# Altium schematic sheet FPGA_POWER.SchDoc
size A4
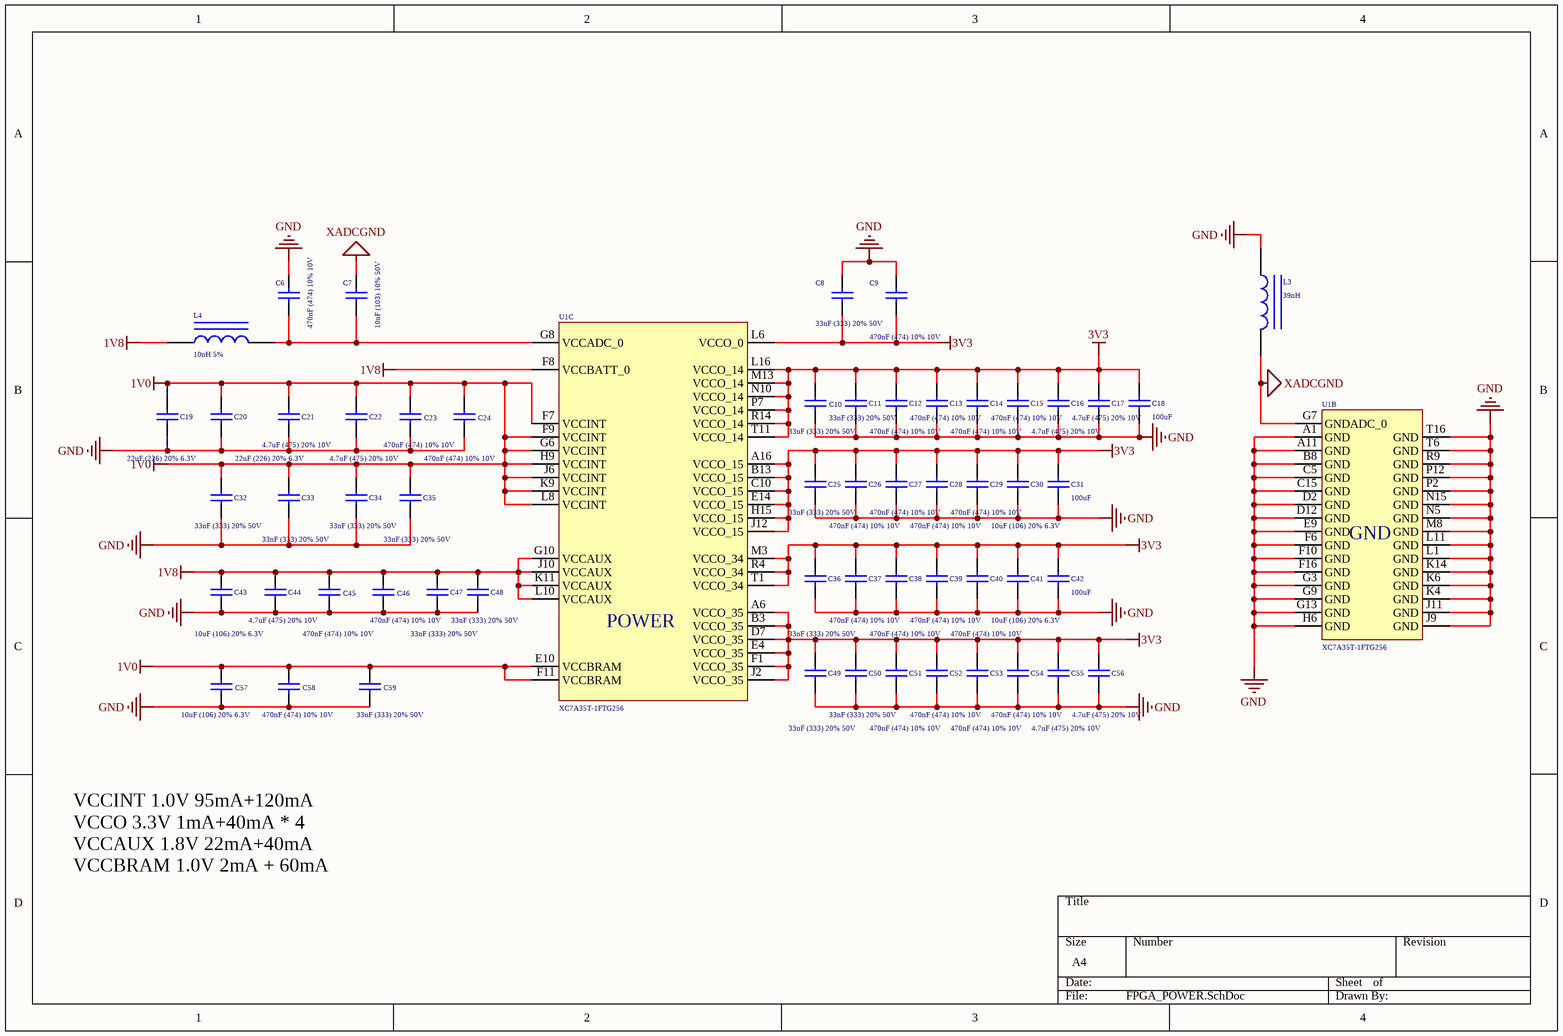
[diagram p0: FPGA_POWER.SchDoc]

## Parts
C6  470nF (474) 10% 10V  [0402_C]
C7  10nF (103) 10% 50V  [0402_C]
C8  33nF (333) 20% 50V  [0402_C]
C9  470nF (474) 10% 10V  [0402_C]
C10  33nF (333) 20% 50V  [0402_C]
C11  33nF (333) 20% 50V  [0402_C]
C12  470nF (474) 10% 10V  [0402_C]
C13  470nF (474) 10% 10V  [0402_C]
C14  470nF (474) 10% 10V  [0402_C]
C15  470nF (474) 10% 10V  [0402_C]
C16  4.7uF (475) 20% 10V  [0402_C]
C17  4.7uF (475) 20% 10V  [0402_C]
C18  value 100uF  [LC-1206]  (hidden comment: Cap)
C19  22uF (226) 20% 6.3V  [0603_C]
C20  22uF (226) 20% 6.3V  [0603_C]
C21  4.7uF (475) 20% 10V  [0402_C]
C22  4.7uF (475) 20% 10V  [0402_C]
C23  470nF (474) 10% 10V  [0402_C]
C24  470nF (474) 10% 10V  [0402_C]
C25  33nF (333) 20% 50V  [0402_C]
C26  470nF (474) 10% 10V  [0402_C]
C27  470nF (474) 10% 10V  [0402_C]
C28  470nF (474) 10% 10V  [0402_C]
C29  470nF (474) 10% 10V  [0402_C]
C30  10uF (106) 20% 6.3V  [0402_C]
C31  value 100uF  [LC-1206]  (hidden comment: Cap)
C32  33nF (333) 20% 50V  [0402_C]
C33  33nF (333) 20% 50V  [0402_C]
C34  33nF (333) 20% 50V  [0402_C]
C35  33nF (333) 20% 50V  [0402_C]
C36  33nF (333) 20% 50V  [0402_C]
C37  470nF (474) 10% 10V  [0402_C]
C38  470nF (474) 10% 10V  [0402_C]
C39  470nF (474) 10% 10V  [0402_C]
C40  470nF (474) 10% 10V  [0402_C]
C41  10uF (106) 20% 6.3V  [0402_C]
C42  value 100uF  [LC-1206]  (hidden comment: Cap)
C43  10uF (106) 20% 6.3V  [0402_C]
C44  4.7uF (475) 20% 10V  [0402_C]
C45  470nF (474) 10% 10V  [0402_C]
C46  470nF (474) 10% 10V  [0402_C]
C47  33nF (333) 20% 50V  [0402_C]
C48  33nF (333) 20% 50V  [0402_C]
C49  33nF (333) 20% 50V  [0402_C]
C50  33nF (333) 20% 50V  [0402_C]
C51  470nF (474) 10% 10V  [0402_C]
C52  470nF (474) 10% 10V  [0402_C]
C53  470nF (474) 10% 10V  [0402_C]
C54  470nF (474) 10% 10V  [0402_C]
C55  4.7uF (475) 20% 10V  [0402_C]
C56  4.7uF (475) 20% 10V  [0402_C]
C57  10uF (106) 20% 6.3V  [0402_C]
C58  470nF (474) 10% 10V  [0402_C]
C59  33nF (333) 20% 50V  [0402_C]
L3  39nH  [0402_L]
L4  10nH 5%  [0402_L]
U1  XC7A35T-1FTG256  [BGA100P9X9-81A]  (parts B,C of 7)

## Nets
1V0: C19.2 C20.2 C21.2 C22.2 C23.2 C24.2 C32.2 C33.2 C34.2 C35.2 C57.2 C58.2 C59.2 U1.E10(VCCBRAM) U1.F7(VCCINT) U1.F9(VCCINT) U1.F11(VCCBRAM) U1.G6(VCCINT) U1.H9(VCCINT) U1.J6(VCCINT) U1.K9(VCCINT) U1.L8(VCCINT)
1V8: C43.2 C44.2 C45.2 C46.2 C47.2 C48.2 L4.1 U1.F8(VCCBATT_0) U1.G10(VCCAUX) U1.J10(VCCAUX) U1.K11(VCCAUX) U1.L10(VCCAUX)
3V3: C8.1 C9.1 C10.2 C11.2 C12.2 C13.2 C14.2 C15.2 C16.2 C17.2 C18.2 C25.2 C26.2 C27.2 C28.2 C29.2 C30.2 C31.2 C36.2 C37.2 C38.2 C39.2 C40.2 C41.2 C42.2 C49.2 C50.2 C51.2 C52.2 C53.2 C54.2 C55.2 C56.2 U1.A6(VCCO_35) U1.A16(VCCO_15) U1.B3(VCCO_35) U1.B13(VCCO_15) U1.C10(VCCO_15) U1.D7(VCCO_35) U1.E4(VCCO_35) U1.E14(VCCO_15) U1.F1(VCCO_35) U1.H15(VCCO_15) U1.J2(VCCO_35) U1.J12(VCCO_15) U1.L6(VCCO_0) U1.L16(VCCO_14) U1.M3(VCCO_34) U1.M13(VCCO_14) U1.N10(VCCO_14) U1.P7(VCCO_14) U1.R4(VCCO_34) U1.R14(VCCO_14) U1.T1(VCCO_34) U1.T11(VCCO_14)
GND: C6.2 C8.2 C9.2 C10.1 C11.1 C12.1 C13.1 C14.1 C15.1 C16.1 C17.1 C18.1 C19.1 C20.1 C21.1 C22.1 C23.1 C24.1 C25.1 C26.1 C27.1 C28.1 C29.1 C30.1 C31.1 C32.1 C33.1 C34.1 C35.1 C36.1 C37.1 C38.1 C39.1 C40.1 C41.1 C42.1 C43.1 C44.1 C45.1 C46.1 C47.1 C48.1 C49.1 C50.1 C51.1 C52.1 C53.1 C54.1 C55.1 C56.1 C57.1 C58.1 C59.1 L3.1 U1.A1(GND) U1.A11(GND) U1.B8(GND) U1.C5(GND) U1.C15(GND) U1.D2(GND) U1.D12(GND) U1.E9(GND) U1.F6(GND) U1.F10(GND) U1.F16(GND) U1.G3(GND) U1.G9(GND) U1.G13(GND) U1.H6(GND) U1.J9(GND) U1.J11(GND) U1.K4(GND) U1.K6(GND) U1.K14(GND) U1.L1(GND) U1.L11(GND) U1.M8(GND) U1.N5(GND) U1.N15(GND) U1.P2(GND) U1.P12(GND) U1.R9(GND) U1.T6(GND) U1.T16(GND)
XADCGND: C7.2 L3.2 U1.G7(GNDADC_0)
NetC6_1: C6.1 C7.1 L4.2 U1.G8(VCCADC_0)

## Notes on the sheet
- VCCINT 1.0V 95mA+120mA
  VCCO 3.3V 1mA+40mA * 4
  VCCAUX 1.8V 22mA+40mA
  VCCBRAM 1.0V 2mA + 60mA
- (in symbol XC7A35T-1FTG256, part C) POWER

## Library data of the parts
C6 C9 C12-C15 C23 C24 C26-C29 C37-C40 C45 C46 C51-C54 C58 = 0402 470nF (474) 10% 10V: 贴片电容; ComponentLink1Description: 供应商链接; ComponentLink1URL: http://www.szlcsc.com/product/details_48344.html; Package: 0402; Supplier: LC; SuppliersPartNumber: C47339
C7 = 0402 10nF (103) 10% 50V: 贴片电容; ComponentLink1Description: 供应商链接; ComponentLink1URL: http://www.szlcsc.com/product/details_15869.html; Package: 0402; Supplier: LC; SuppliersPartNumber: C15195
C8 C10 C11 C25 C32-C36 C47-C50 C59 = 0402 33nF (333) 20% 50V: 贴片电容; ComponentLink1Description: 供应商链接; ComponentLink1URL: http://www.szlcsc.com/product/details_1937.html; Package: 0402; Supplier: LC; SuppliersPartNumber: C1585
C16 C17 C21 C22 C44 C55 C56 = 0402 4.7uF (475) 20% 10V: 贴片电容; ComponentLink1Description: 供应商链接; ComponentLink1URL: http://www.szlcsc.com/product/details_24469.html; Package: 0402; Supplier: LC; SuppliersPartNumber: C23733
C18 C31 C42 = Cap: 贴片电容; Published: 8-Jun-2000; LatestRevisionDate: 17-Jul-2002; LatestRevisionNote: Re-released for DXP Platform.; PackageReference: RAD-0.3; Publisher: Altium Limited
C19 C20 = 0603 22uF (226) 20% 6.3V: 贴片电容; ComponentLink1Description: 供应商链接; ComponentLink1URL: http://www.szlcsc.com/product/details_60514.html; Package: 0603; Supplier: LC; SuppliersPartNumber: C59461
C30 C41 C43 C57 = 0402 10uF (106) 20% 6.3V: 贴片电容; ComponentLink1Description: 供应商链接; ComponentLink1URL: http://www.szlcsc.com/product/details_16204.html; Package: 0402; Supplier: LC; SuppliersPartNumber: C15525
L3 = 0402 39nH: 贴片电感; ComponentLink1Description: 供应商链接; ComponentLink1URL: http://www.szlcsc.com/product/details_27187.html; Package: 0402; Supplier: LC; SuppliersPartNumber: C26443
L4 = 0402 10nH 5%: 贴片电感; ComponentLink1Description: 供应商链接; ComponentLink1URL: http://www.szlcsc.com/product/details_27896.html; Package: 0402; Supplier: LC; SuppliersPartNumber: C27147